# Altium schematic sheet AudioAmplD.SchDoc
size A4
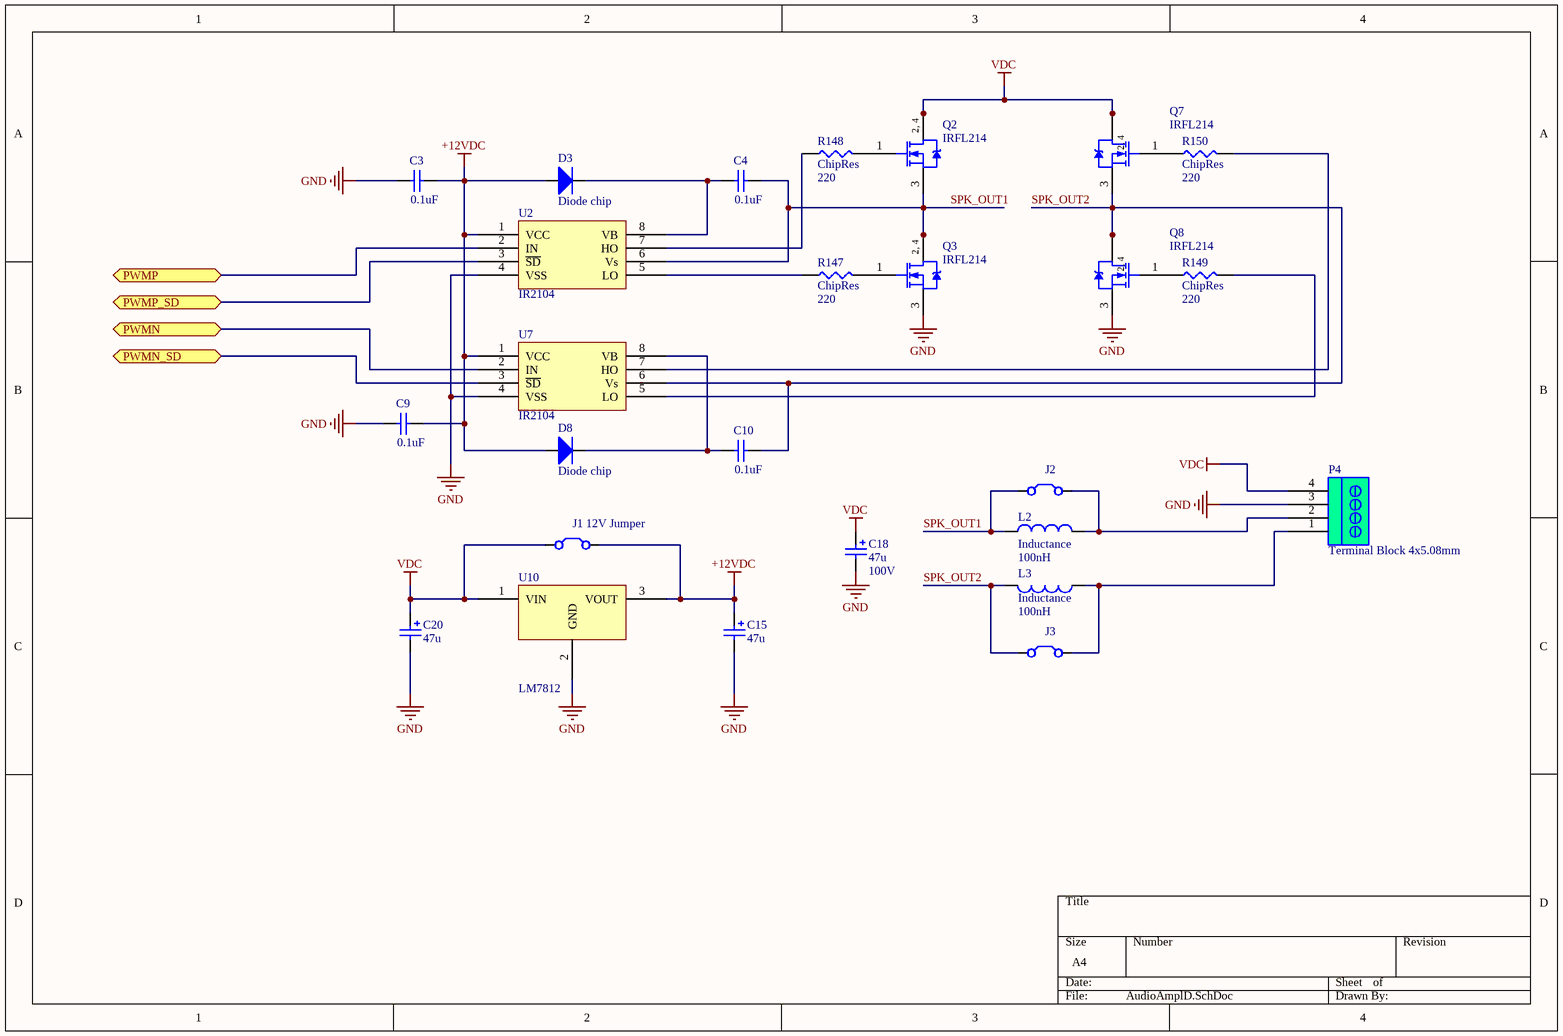
[diagram p0: AudioAmplD.SchDoc]

## Parts
C3  value 0.1uF  [CAP0805]  (hidden comment: ChipCap)
C4  value 0.1uF  [CAP0805]  (hidden comment: ChipCap)
C9  value 0.1uF  [CAP0805]  (hidden comment: ChipCap)
C10  value 0.1uF  [CAP0805]  (hidden comment: ChipCap)
C15  value 47u  [CAPC7343]  (hidden comment: Cap Pol SMD)
C18  value 47u  Voltage: 100V  [CAPPR5-10x17_1]  (hidden comment: Cap Pol 100/47)
C20  value 47u  [CAPC7343]  (hidden comment: Cap Pol SMD)
D3  Diode chip  [SMB1]
D8  Diode chip  [SMB1]
J1  12V Jumper  [J0805]  (net tie, no BOM)
J2  (no value)  [J0805]  (net tie, no BOM)
J3  (no value)  [J0805]  (net tie, no BOM)
L2  Inductance  value 100nH  [Inductor]
L3  Inductance  value 100nH  [Inductor]
P4  Terminal Block 4x5.08mm  [Socket 4x5.08]
Q2  IRFL214  [SOT-223_N]
Q3  IRFL214  [SOT-223_N]
Q7  IRFL214  [SOT-223_N]
Q8  IRFL214  [SOT-223_N]
R147  ChipRes  value 220  [RES0805]
R148  ChipRes  value 220  [RES0805]
R149  ChipRes  value 220  [RES0805]
R150  ChipRes  value 220  [RES0805]
U2  IR2104  [SOIC8]
U7  IR2104  [SOIC8]
U10  LM7812  [TO-220]

## Ports
PWMN, PWMN_SD, PWMP, PWMP_SD

## Nets
+12VDC: C3.2 C9.2 C15.1 D3.1(A) D8.1(A) J1.1 U2.1(VCC) U7.1(VCC) U10.3(VOUT)
GND: C3.1 C9.1 C15.2 C18.2 C20.2 P4.3 Q3.3(S) Q8.3(S) U2.4(VSS) U7.4(VSS) U10.2(GND)
VDC: C18.1 C20.1 J1.0 P4.4 Q2.2(D) Q2.4(D) Q7.2(D) Q7.4(D) U10.1(VIN)
PWMN: U7.2(IN) ; port PWMN
PWMN_SD: U7.3(~{SD}) ; port PWMN_SD
PWMP: U2.2(IN) ; port PWMP
PWMP_SD: U2.3(~{SD}) ; port PWMP_SD
SPK_OUT1: C4.2 J2.0 L2.1 Q2.3(S) Q3.2(D) Q3.4(D) U2.6(Vs)
SPK_OUT2: C10.2 J3.0 L3.1 Q7.3(S) Q8.2(D) Q8.4(D) U7.6(Vs)
NetC4_1: C4.1 D3.2(K) U2.8(VB)
NetC10_1: C10.1 D8.2(K) U7.8(VB)
NetJ2_1: J2.1 L2.2 P4.2
NetJ3_1: J3.1 L3.2 P4.1
NetQ2_1: Q2.1(G) R148.2
NetQ3_1: Q3.1(G) R147.2
NetQ7_1: Q7.1(G) R150.1
NetQ8_1: Q8.1(G) R149.1
NetR147_1: R147.1 U2.5(LO)
NetR148_1: R148.1 U2.7(HO)
NetR149_2: R149.2 U7.5(LO)
NetR150_2: R150.2 U7.7(HO)

## Notes on the sheet
- (in symbol IRFL214) 2, 4

## Library data of the parts
C3 C4 C9 C10 = ChipCap: Capacitor; Published: 8-Jun-2000; LatestRevisionDate: 17-Jul-2002; LatestRevisionNote: Re-released for DXP Platform.; PackageReference: RAD-0.3; Publisher: Altium Limited
C15 C20 = Cap Pol Chip: Polarized Capacitor (Radial); Supplier 1: Digi-Key; Supplier Part Number 1: 399-4029-1-ND
C18 = Cap Pol 100/47: Polarized Capacitor (Radial); Supplier 1: Digi-Key; Supplier Part Number 1: P1284-ND
D3 D8 = Diode chip: Voltage: 1000V; Current (continuous): 3A; Current (peak, sine 8,3 ms): 150V; Junction capacitance: 50pF
J1-J3 = Jumper
L2 L3 = ChipInductance
P4 = Socket_4x5.08_RA_2Wall: Terminal Block Socket Right Angle 4x5.08mm 2-Wall
Q2 Q3 Q7 Q8 = IRFL214: HEXFET Power MOSFET; Note: Pin 2 is electrically connected to pin 4.; Published: 8-Jun-2000; LatestRevisionDate: 20-Nov-2009; LatestRevisionNote: IPC-7351 Footprint Added.; DatasheetVersion: PD-9.862; PackageReference: SOT-223; Publisher: Altium Limited; PackageDescription: 4-Pin SOT-223 Package 2.3 mm Pitch, 7 mm Lead Span; Code_JEDEC: TO-261-AA; Code_IPC: SOT223-4; ComponentLink1Description: Manufacturer Link; ComponentLink1URL: http://www.irf.com/; ComponentLink2Description: Datasheet; ComponentLink2URL: http://www.irf.com/product-info/datasheets/data/irfl214.pdf
R147-R150 = ChipRes: Chip resistor
U2 U7 = IR2104: IR MOSFET Driver
U10 = LM7805: Linear voltage regulator 1A